# EAGLE board IVEEDRIS-SCIR (EAGLE 9.0.1), part 1 of 2
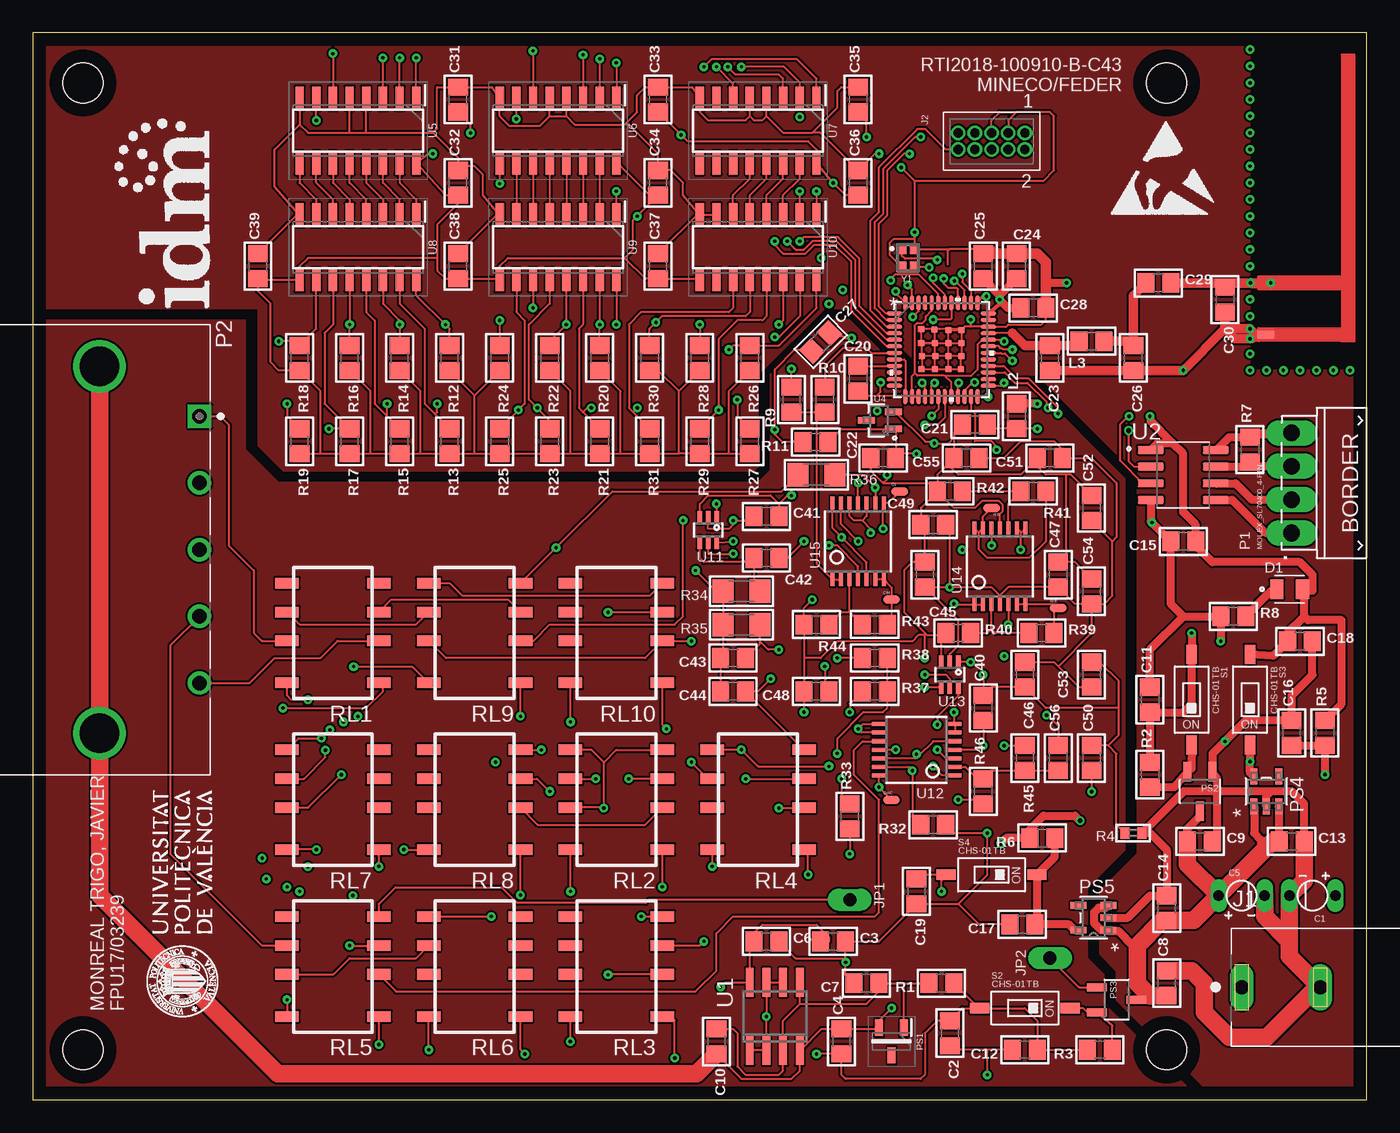
[diagram p5: board, top side]
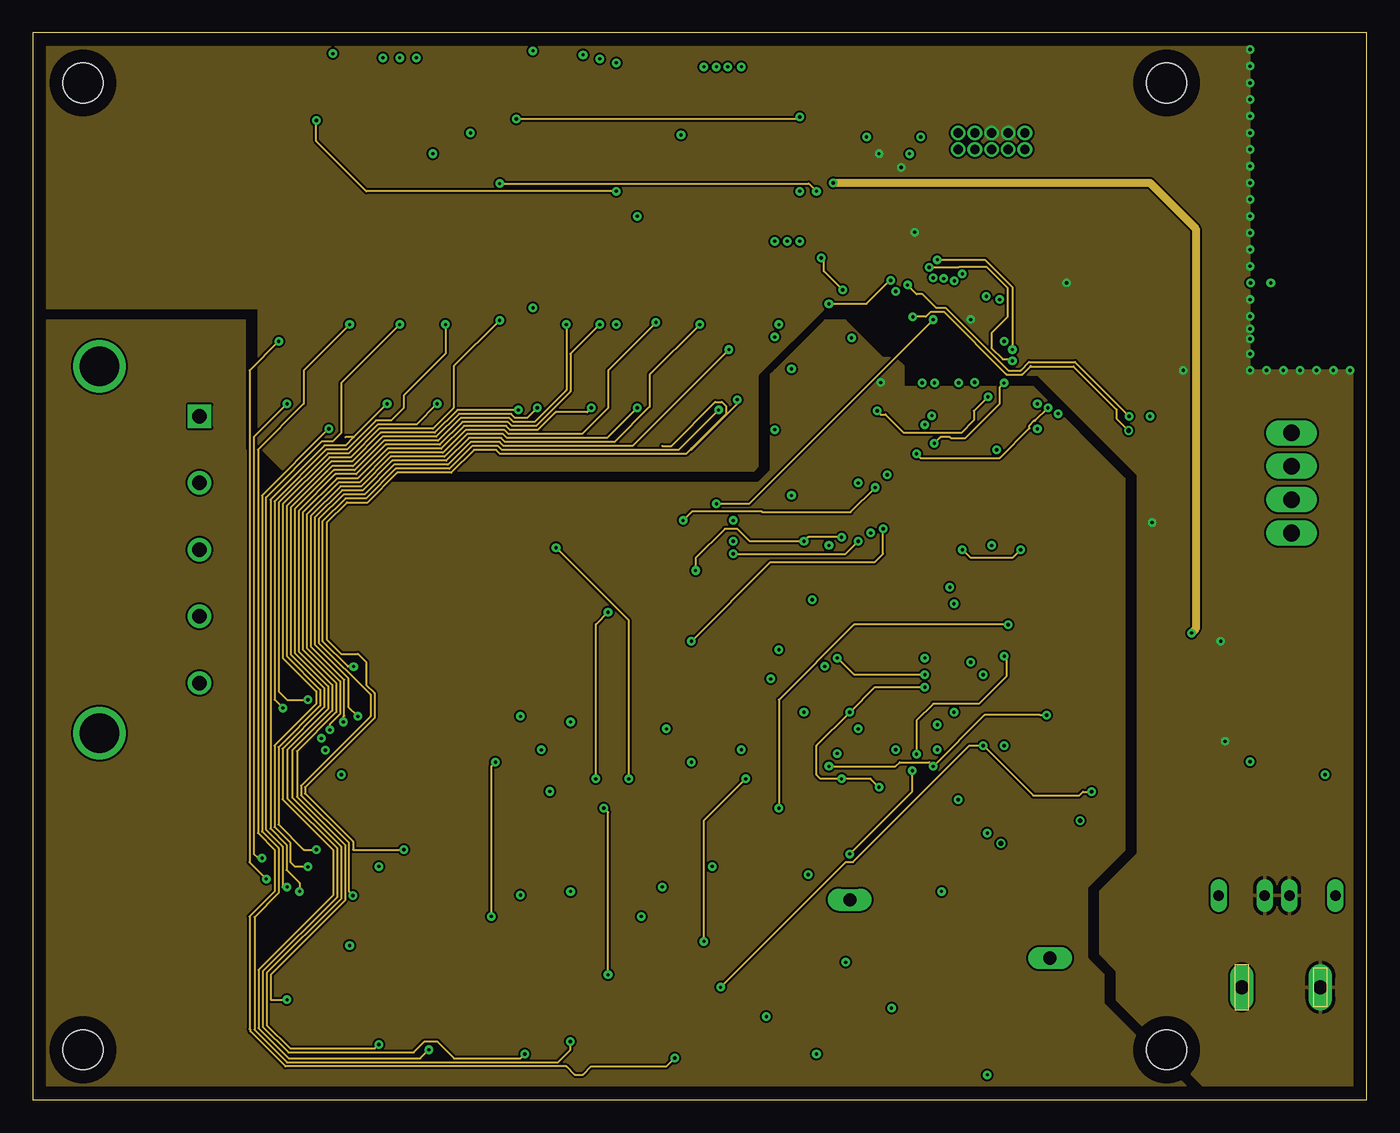
[diagram p6: board, inner layer Route2]
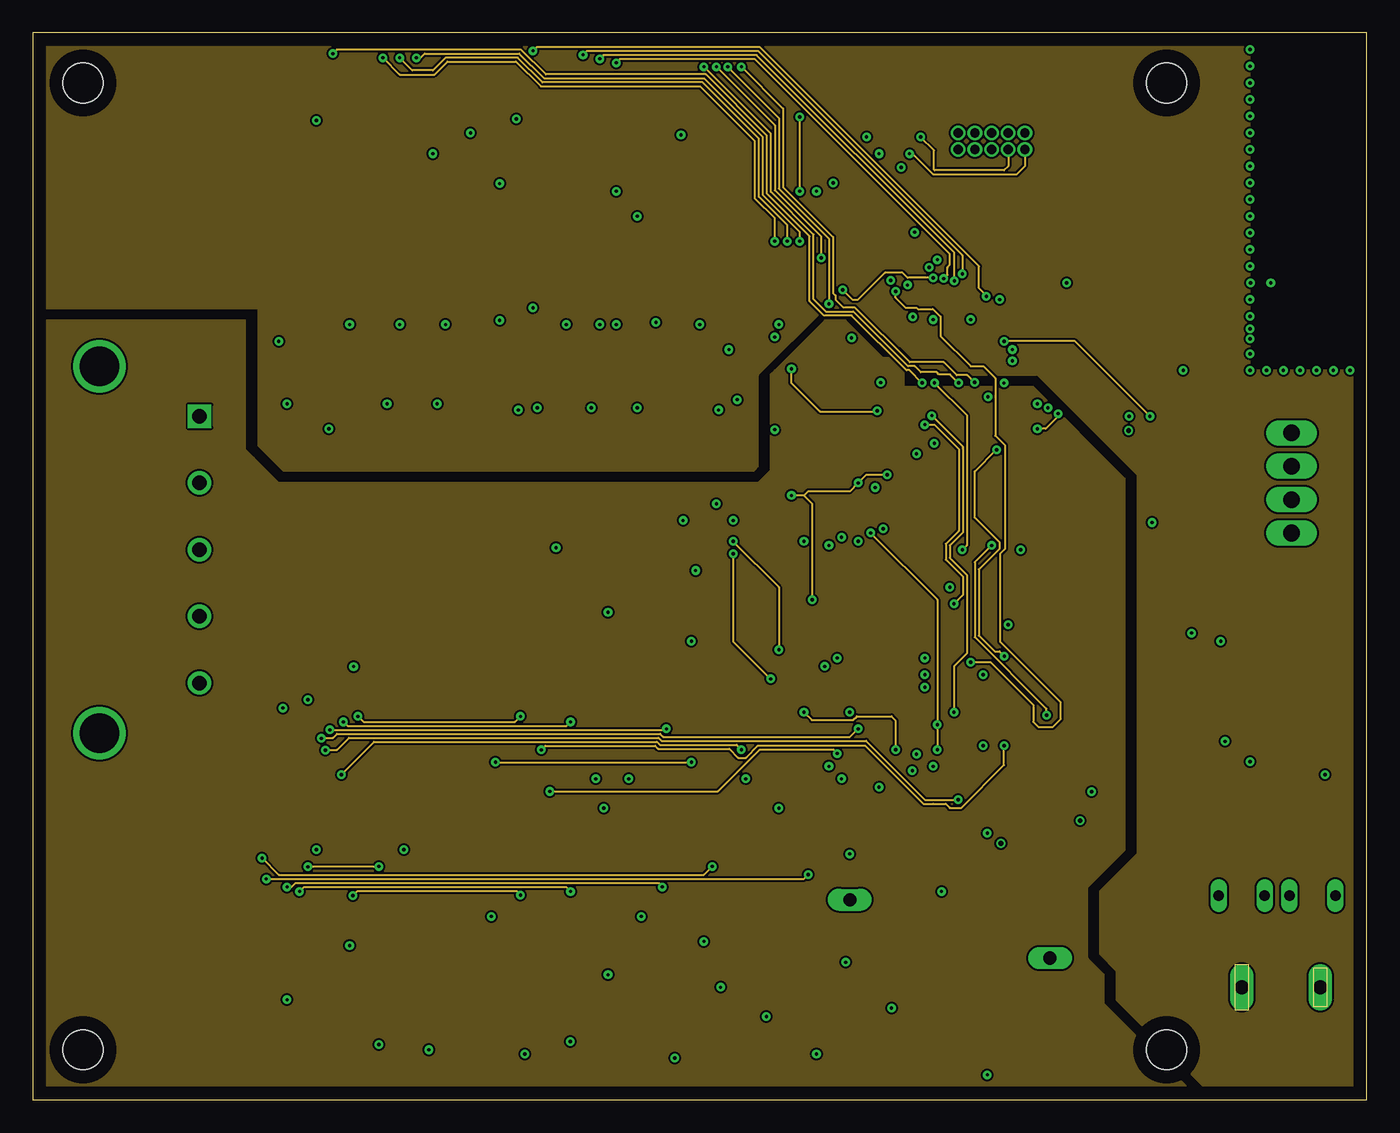
[diagram p7: board, inner layer Route15]
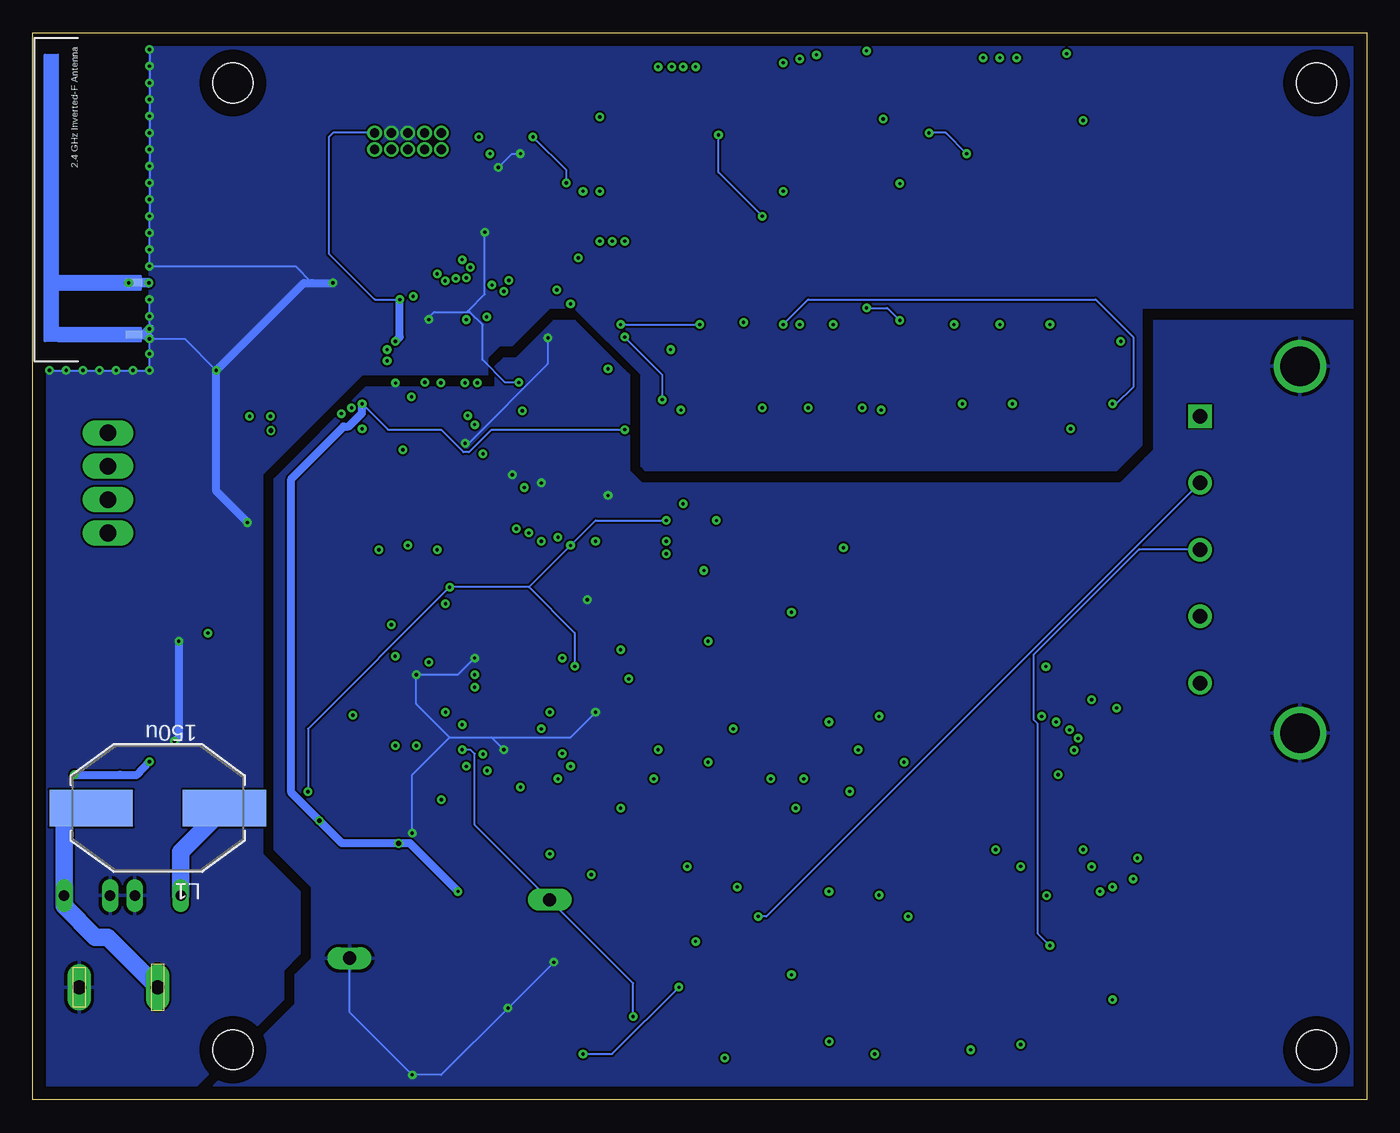
[diagram p8: board, bottom side, seen from below]

Size 101.6 x 81.28 mm. Coordinates in mm from the lower left corner, seen from the top.
Outline: 0,0 101.6,0 101.6,81.28 0,81.28 0,0
Copper layers (1*2*15*16): Top 0.035mm / dielectric 0.5mm / Route2 0.035mm / dielectric 0.5mm / Route15 0.035mm / dielectric 0.5mm / Bottom 0.035mm
Design rules "default *": minimum track width 6mil, minimum drill 0.25mm, track to track 6mil, track to pad 6mil, pad to pad 6mil, via to via 6mil, smd to smd 6mil, copper to edge 40mil, drill to drill 6mil, minimum pad ring 6mil, minimum via ring 6mil, stop-mask expansion 4mil, vias tented up to drill 0mil, thermal gap 10mil
Holes 3.05 mm at 86.36,3.81 86.36,77.47 3.81,77.47 3.81,3.81

## Footprints (pad centres in the part's own frame; a part is rotated, then mirrored left to right if it is on the bottom)
RF2.4GHZ_FINVERTED_ANTENNA = smd 0.635 x 1.27 bottom: GNDB 0.508,-5.791 | smd 0.635 x 1.27: GNDT 0.508,-5.791; RF 4.47,-5.791 | drill 0.25 pad 0.65: P$1 4.445,-5.397
CAP_ALUMINIUM = drill 0.8 pad 1.27 long: 1 -1.75,0; 2 1.75,0
0805 = smd 1.3 x 1.5: 1 -0.95,0; 2 0.95,0
NOSOLDERPAD = smd 1.27 x 0.635: P$1 0,0
LEDC2012X135N = smd 1.01 x 1.47: A 0.98,0; C -0.98,0
CUI_PJ-037A = drill 1.067 pad 1.778 long: 1 0,0; 2 6,0
FTSH-105-XX-XX-D = drill 0.711 pad 1.118: 1 -2.54,-0.635; 2 -2.54,0.635; 3 -1.27,-0.635; 4 -1.27,0.635; 5 0,-0.635; 6 0,0.635; 7 1.27,-0.635; 8 1.27,0.635; 9 2.54,-0.635; 10 2.54,0.635
1X01_OVAL = drill 1 pad 1.676 long: 1 0,0
IND_PM3308-RC = smd 6.35 x 2.794: 1 -5.08,0; 2 5.08,0
MOLEX_SL70400_4-PIN = drill 1.27 pad 1.93 long: 1 3.81,0; 2 1.27,0; 3 -1.27,0; 4 -3.81,0
TE_1-316130-2 = drill 1.1 pad 1.778 square: 1 0,0 | drill 1.1 pad 1.778: 2 5.08,0; 3 10.16,0; 4 15.24,0; 5 20.32,0 | drill 3 pad 4: SH1 -3.81,-7.62; SH2 24.13,-7.62
SOT95P237X112-3N = smd 1.25 x 0.6: 1 -1.05,0.95; 2 -1.05,-0.95; 3 1.05,0
SOT23-A = smd 0.6 x 1.5: 1 -0.95,-1.5; 2 0.95,-1.5; 3 0,1.5
TSOT-23_S5 = smd 1.219 x 0.508: 1 -1.143,0.95; 2 -1.143,0; 3 -1.143,-0.95; 4 1.143,-0.95; 5 1.143,0.95
0402 = smd 0.7 x 0.9: 1 -0.65,0; 2 0.65,0
1206 = smd 1.6 x 1.8: 1 -1.4,0; 2 1.4,0
G6KU-2F-Y = smd 0.8 x 1.8: 1 -3.8,-3.5; 2 -0.6,-3.5; 3 1.6,-3.5; 4 3.8,-3.5; 5 3.8,3.5; 6 1.6,3.5; 7 -0.6,3.5; 8 -3.8,3.5
CHS-01TB = smd 0.8 x 1.47: 1 0,3.45; 2 0,-3.45
SO8 = smd 0.6 x 2.2: 1 -1.905,-2.6; 2 -0.635,-2.6; 3 0.635,-2.6; 4 1.905,-2.6; 5 1.905,2.6; 6 0.635,2.6; 7 -0.635,2.6; 8 -1.905,2.6
SOIC127P600X175-8N = smd 1.97 x 0.59: 1 -2.475,1.905; 2 -2.475,0.635; 3 -2.475,-0.635; 4 -2.475,-1.905; 5 2.475,-1.905; 6 2.475,-0.635; 7 2.475,0.635; 8 2.475,1.905
LQFN48_7X7_EXTENDED = smd 1.168 x 0.305: 1 -3.581,2.75; 2 -3.581,2.25; 3 -3.581,1.75; 4 -3.581,1.25; 5 -3.581,0.75; 6 -3.581,0.25; 7 -3.581,-0.25; 8 -3.581,-0.75; 9 -3.581,-1.25; 10 -3.581,-1.75; 11 -3.581,-2.25; 12 -3.581,-2.75; 25 3.581,-2.75; 26 3.581,-2.25; 27 3.581,-1.75; 28 3.581,-1.25; 29 3.581,-0.75; 30 3.581,-0.25; 31 3.581,0.25; 32 3.581,0.75; 33 3.581,1.25; 34 3.581,1.75; 35 3.581,2.25; 36 3.581,2.75 | smd 0.305 x 1.168: 13 -2.75,-3.581; 14 -2.25,-3.581; 15 -1.75,-3.581; 16 -1.25,-3.581; 17 -0.75,-3.581; 18 -0.25,-3.581; 19 0.25,-3.581; 20 0.75,-3.581; 21 1.25,-3.581; 22 1.75,-3.581; 23 2.25,-3.581; 24 2.75,-3.581; 37 2.75,3.556; 38 2.25,3.556; 39 1.75,3.556; 40 1.25,3.556; 41 0.75,3.556; 42 0.25,3.556; 43 -0.25,3.556; 44 -0.75,3.556; 45 -1.25,3.556; 46 -1.75,3.556; 47 -2.25,3.556; 48 -2.75,3.556 | smd 0.508 x 0.508: 49 -1.549,1.549; 50 -0.533,1.524; 51 0.508,1.499; 52 1.499,1.499; 53 -1.549,0.508; 54 -0.508,0.508; 55 0.508,0.508; 56 1.524,0.483; 57 1.499,-0.508; 58 0.508,-0.508; 59 -0.483,-0.508; 60 -1.499,-0.508; 61 -1.524,-1.499; 62 -0.508,-1.499; 63 0.508,-1.499; 64 1.473,-1.499
KS_3_ADI-M = smd 0.502 x 1.316: 1 -0.65,-1.101; 2 0.65,-1.101; 3 0,0.951
SOIC127P600X175-16N = smd 1.778 x 0.635: 1 -2.458,4.445; 2 -2.458,3.175; 3 -2.458,1.905; 4 -2.458,0.635; 5 -2.458,-0.635; 6 -2.458,-1.905; 7 -2.458,-3.175; 8 -2.458,-4.445; 9 2.458,-4.445; 10 2.458,-3.175; 11 2.458,-1.905; 12 2.458,-0.635; 13 2.458,0.635; 14 2.458,1.905; 15 2.458,3.175; 16 2.458,4.445
SC70-6L = smd 0.35 x 1: 1 -0.65,-0.95; 2 0,-0.95; 3 0.65,-0.95; 4 0.65,0.95; 5 0,0.95; 6 -0.65,0.95
TSSOP14-NOTHERMALPAD = smd 0.305 x 0.991: 1 -1.95,-2.918; 2 -1.3,-2.918; 3 -0.65,-2.918; 4 0,-2.918; 5 0.65,-2.918; 6 1.3,-2.918; 7 1.95,-2.918; 8 1.95,2.918; 9 1.3,2.918; 10 0.65,2.918; 11 0,2.918; 12 -0.65,2.918; 13 -1.3,2.918; 14 -1.95,2.918
XRCGB32_F = smd 0.75 x 0.7: 1 -0.675,-0.5; 2 0.675,-0.5; 3 0.675,0.5; 4 -0.675,0.5

## Placement (x,y rotation side)
AE1  F_INVERTED_ANTENNA_2.4G  [RF2.4GHZ_FINVERTED_ANTENNA]  99.69,57.78 90 bottom
C1  1m  [CAP_ALUMINIUM]  97.47,15.56 180 top
C2  100n  [0805]  69.85,5.08 270 top
C3  10u  [0805]  60.96,12.06 0 top
C4  10n  [0805]  61.59,4.45 90 top
C5  1m  [CAP_ALUMINIUM]  92.08,15.56 0 top
C6  10n  [0805]  55.88,12.06 0 top
C7  100n  [0805]  63.5,8.89 180 top
C8  1u  [0805]  86.36,8.89 90 top
C9  1u  [0805]  88.9,19.68 0 top
C10  10n  [0805]  52.07,4.45 270 top
C11  1u  [0805]  85.09,30.48 90 top
C12  1u  [0805]  75.56,3.81 180 top
C13  1u  [0805]  95.89,19.68 0 top
C14  1u  [0805]  86.36,14.61 90 top
C15  100n  [0805]  87.63,42.55 180 top
C16  1u  [0805]  95.89,27.94 90 top
C17  1U  [0805]  75.36,13.36 180 top
C18  10u  [0805]  96.52,34.92 0 top
C19  10u  [0805]  67.31,15.88 270 top
C20  10u  [0805]  62.87,54.93 270 top
C21  1u  [0805]  71.75,51.44 180 top
C22  0.1u  [0805]  64.77,48.9 180 top
C23  0.7p  [0805]  77.47,56.52 270 top
C24  0.1u  [0805]  74.93,63.5 90 top
C25  0.1u  [0805]  72.39,63.5 90 top
C26  0.7p  [0805]  83.82,56.52 270 top
C27  0.1u  [0805]  60.01,57.72 45 top
C28  12p  [0805]  76.2,60.33 0 top
C29  10p  [0805]  85.72,62.23 0 top
C30  10p  [0805]  90.81,60.96 270 top
C31  100n  [0805]  32.38,76.2 90 top
C32  1u  [0805]  32.38,69.85 90 top
C33  100n  [0805]  47.62,76.2 90 top
C34  1u  [0805]  47.62,69.85 90 top
C35  100n  [0805]  62.87,76.2 90 top
C36  1u  [0805]  62.87,69.85 90 top
C37  100n  [0805]  47.62,63.5 90 top
C38  100n  [0805]  32.38,63.5 90 top
C39  100n  [0805]  17.14,63.5 90 top
C40  10n  [0805]  72.39,29.84 90 top
C41  100n  [0805]  55.88,44.45 0 top
C42  [0805]  55.88,41.27 0 top
C43  [0805]  53.34,33.66 180 top
C44  [0805]  53.34,31.11 180 top
C45  10n  [0805]  67.94,40.01 90 top
C46  100n  [0805]  75.56,32.38 270 top
C47  10n  [0805]  78.11,40.01 90 top
C48  1u  [0805]  59.69,31.11 180 top
C49  1u  [0805]  68.58,43.81 180 top
C50  100n  [0805]  80.64,26.04 90 top
C51  100n  [0805]  77.47,48.9 180 top
C52  100n  [0805]  80.64,45.09 90 top
C53  100n  [0805]  80.64,32.38 90 top
C54  100n  [0805]  80.64,38.73 90 top
C55  100n  [0805]  71.12,48.9 180 top
C56  22p  [0805]  78.11,26.04 90 top
CI  [NOSOLDERPAD]  66.04,46.35 0 top
CM  [NOSOLDERPAD]  65.41,38.1 0 top
D1  SM0805UGC  [LEDC2012X135N]  95.73,38.89 0 top
DAC  [NOSOLDERPAD]  65.41,22.86 0 top
J1  PJ-037A  [CUI_PJ-037A]  92.08,8.57 0 top
J2  FTSH-105-XX-XX-D  [FTSH-105-XX-XX-D]  73.03,73.03 180 top
JP1  VGND  [1X01_OVAL]  62.23,15.24 270 top
JP2  AGND  [1X01_OVAL]  77.47,10.79 90 top
L1  150u  [IND_PM3308-RC]  92.08,22.23 180 bottom
L2  0.1uH  [0805]  74.93,52.07 90 top
L3  0.0051uH  [0805]  80.64,57.78 0 top
P1  MOLEX_SL70400_4-PIN  [MOLEX_SL70400_4-PIN]  95.89,46.99 90 top
P2  1-316130-2  [TE_1-316130-2]  12.7,52.07 270 top
PS1  LM4040DEM3-2.5_NOPB  [SOT95P237X112-3N]  65.41,4.45 270 top
PS2  MCP1702  [SOT23-A]  88.9,23.5 180 top
PS3  MCP1702  [SOT23-A]  82.55,7.62 270 top
PS4  [TSOT-23_S5]  93.95,23.5 90 top
PS5  [TSOT-23_S5]  80.8,13.87 180 top
R1  10k  [0805]  69.22,8.89 180 top
R2  0  [0805]  85.09,24.77 90 top
R3  0  [0805]  81.28,3.81 180 top
R4  [0402]  83.82,20.32 180 top
R5  0  [0805]  98.42,27.94 90 top
R6  0  [0805]  76.89,19.94 180 top
R7  120  [0805]  92.71,49.53 90 top
R8  220  [0805]  91.44,36.83 0 top
R9  0  [0805]  57.78,53.34 270 top
R10  0  [0805]  60.33,53.34 270 top
R11  820  [0805]  59.63,50.1 180 top
R12  50  [0805]  31.75,56.52 270 top
R13  50  [0805]  31.75,50.16 270 top
R14  50  [0805]  27.94,56.52 270 top
R15  50  [0805]  27.94,50.16 270 top
R16  50  [0805]  24.13,56.52 270 top
R17  50  [0805]  24.13,50.16 270 top
R18  50  [0805]  20.32,56.52 270 top
R19  50  [0805]  20.32,50.16 270 top
R20  50  [0805]  43.18,56.52 270 top
R21  50  [0805]  43.18,50.16 270 top
R22  50  [0805]  39.37,56.52 270 top
R23  50  [0805]  39.37,50.16 270 top
R24  50  [0805]  35.56,56.52 270 top
R25  50  [0805]  35.56,50.16 270 top
R26  50  [0805]  54.61,56.52 270 top
R27  50  [0805]  54.61,50.16 270 top
R28  50  [0805]  50.8,56.52 270 top
R29  50  [0805]  50.8,50.16 270 top
R30  50  [0805]  46.99,56.52 270 top
R31  50  [0805]  46.99,50.16 270 top
R32  30k  [0805]  68.58,20.95 180 top
R33  20k  [0805]  62.23,21.59 90 top
R34  100k  [1206]  53.98,38.73 180 top
R35  1k  [1206]  53.98,36.2 180 top
R36  12k  [1206]  59.69,47.62 0 top
R37  0  [0805]  64.14,31.11 0 top
R38  0  [0805]  64.14,33.66 0 top
R39  18k  [0805]  76.83,35.56 0 top
R40  27k  [0805]  70.48,35.56 0 top
R41  18k  [0805]  76.2,46.35 0 top
R42  27k  [0805]  69.85,46.35 0 top
R43  18k  [0805]  64.14,36.2 0 top
R44  27k  [0805]  59.69,36.2 0 top
R45  10k  [0805]  75.56,26.04 270 top
R46  10k  [0805]  72.39,23.5 90 top
RE  [NOSOLDERPAD]  73.03,45.09 180 top
RL1  [G6KU-2F-Y]  22.86,35.56 90 top
RL2  [G6KU-2F-Y]  44.45,22.86 90 top
RL3  [G6KU-2F-Y]  44.45,10.16 90 top
RL4  [G6KU-2F-Y]  55.24,22.86 90 top
RL5  [G6KU-2F-Y]  22.86,10.16 90 top
RL6  [G6KU-2F-Y]  33.66,10.16 90 top
RL7  [G6KU-2F-Y]  22.86,22.86 90 top
RL8  [G6KU-2F-Y]  33.66,22.86 90 top
RL9  [G6KU-2F-Y]  33.66,35.56 90 top
RL10  [G6KU-2F-Y]  44.45,35.56 90 top
S1  CHS-01TB  [CHS-01TB]  88.27,30.48 180 top
S2  CHS-01TB  [CHS-01TB]  75.56,6.99 270 top
S3  CHS-01TB  [CHS-01TB]  92.71,30.48 180 top
S4  CHS-01TB  [CHS-01TB]  73.03,17.14 270 top
U1  TLV2462IDG4  [SO8]  56.52,6.35 0 top
U2  MAX3490ECSA+  [SOIC127P600X175-8N]  87.63,47.6 0 top
U3  MKW41Z512VHT4LQFN48_7X7_EXTENDED  [LQFN48_7X7_EXTENDED]  69.22,57.15 0 top
U4  [KS_3_ADI-M]  64.45,51.75 90 top
U5  74HCT238D  [SOIC127P600X175-16N]  24.77,73.83 270 top
U6  74HCT238D  [SOIC127P600X175-16N]  40.01,73.83 270 top
U7  74HCT238D  [SOIC127P600X175-16N]  55.24,73.83 270 top
U8  ULN2003LVDR  [SOIC127P600X175-16N]  24.77,64.94 270 top
U9  ULN2003LVDR  [SOIC127P600X175-16N]  40.01,64.94 270 top
U10  ULN2003LVDR  [SOIC127P600X175-16N]  55.24,64.94 270 top
U11  ADG849  [SC70-6L]  51.45,43.4 180 top
U12  OPA4376PW  [TSSOP14-NOTHERMALPAD]  67.31,26.67 90 top
U13  ADG849  [SC70-6L]  69.85,32.38 180 top
U14  OPA4376PW  [TSSOP14-NOTHERMALPAD]  73.66,40.64 0 top
U15  OPA4376PW  [TSSOP14-NOTHERMALPAD]  62.87,42.55 0 top
WE  [NOSOLDERPAD]  78.11,37.47 0 top
Y1  XRCGB32M000FBH50R0  [XRCGB32_F]  66.67,64.14 270 top